# Altium project LED PD LKW WH 3000030 (4F00221L_7P00491A).PrjPcb
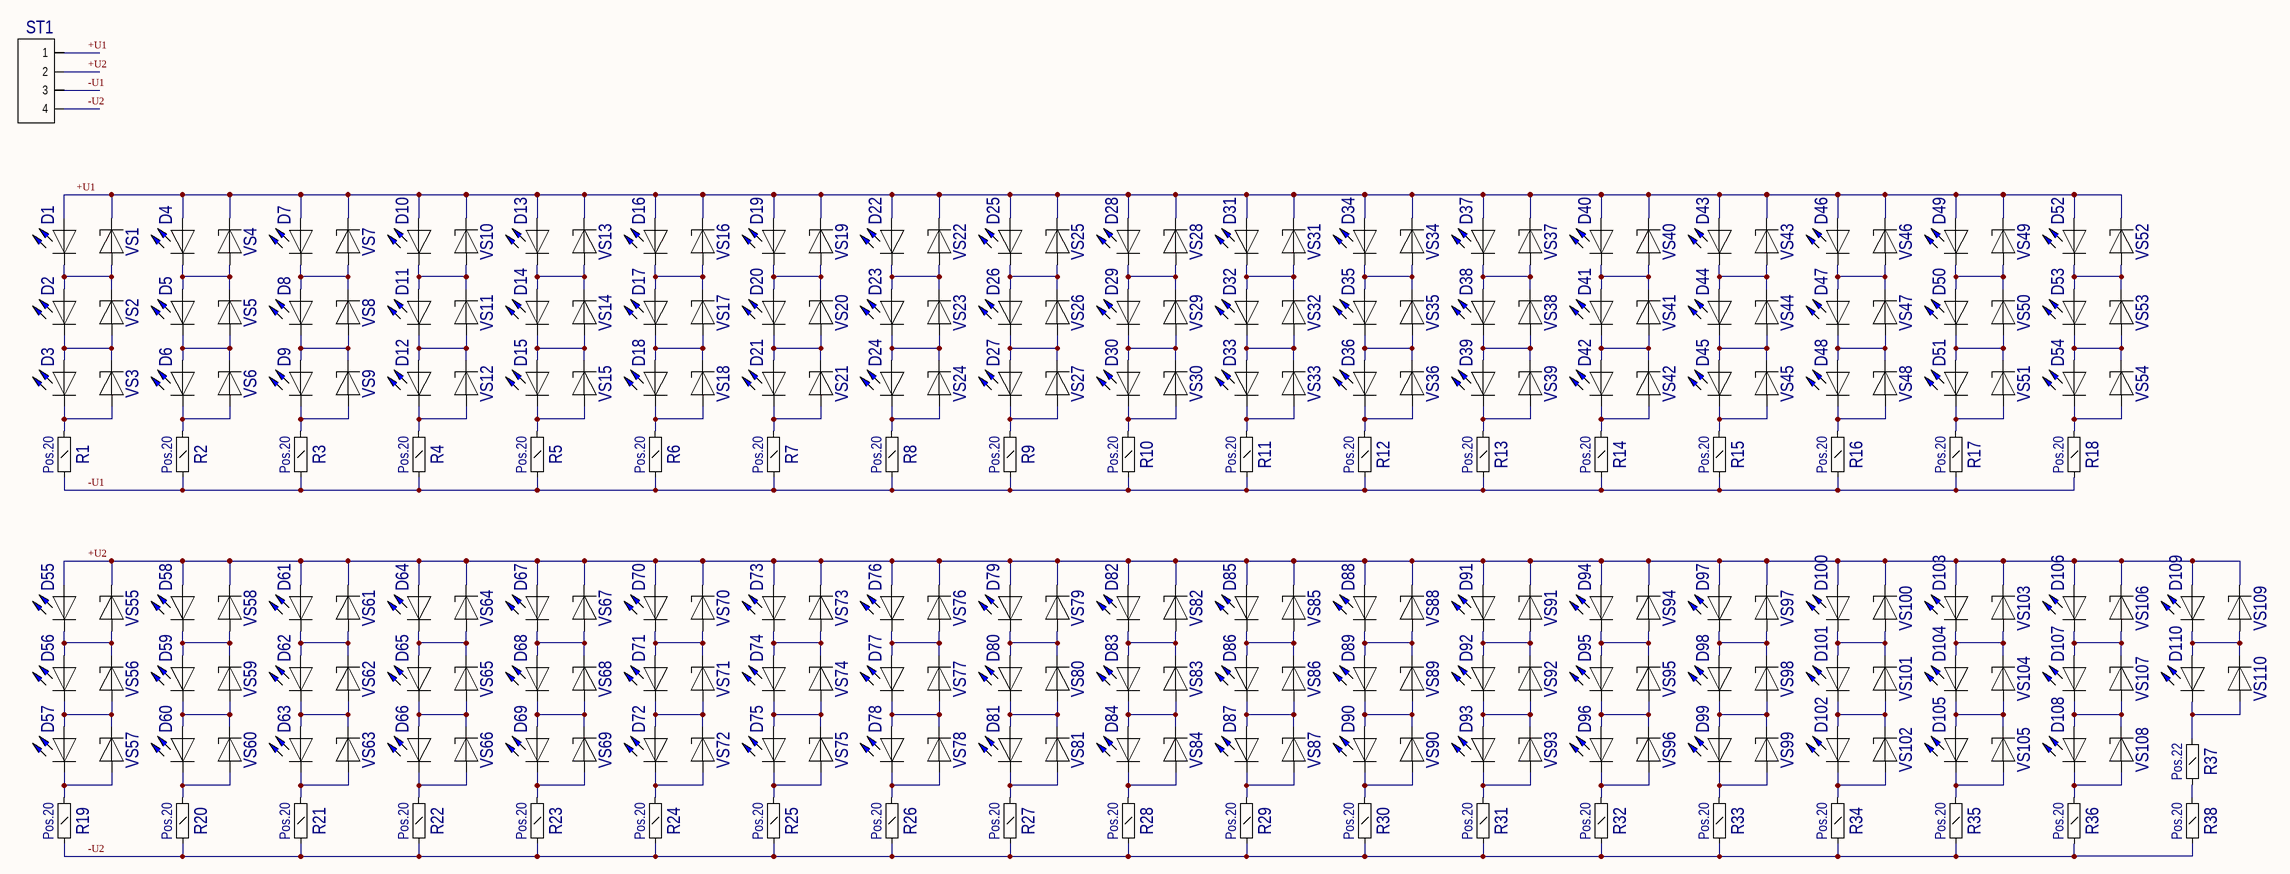
[diagram p0: LED PD LKW WH 3000030 (4F00221L_7P00491A).SchDoc]
1 sheet, 259 parts. Net scope: global (net labels, ports and power ports of the same name join across sheets).
Board file: LED PD LKW WH 3000030 (4F00221L_7P00491A).PcbDoc

## Sheet LED PD LKW WH 3000030 (4F00221L_7P00491A).SchDoc
size 529 x 241 mm

### Parts
D1  T66G_4  [T66G_4]  (value not drawn)
D2  T66G_4  [T66G_4]  (value not drawn)
D3  T66G_4  [T66G_4]  (value not drawn)
D4  T66G_4  [T66G_4]  (value not drawn)
D5  T66G_4  [T66G_4]  (value not drawn)
D6  T66G_4  [T66G_4]  (value not drawn)
D7  T66G_4  [T66G_4]  (value not drawn)
D8  T66G_4  [T66G_4]  (value not drawn)
D9  T66G_4  [T66G_4]  (value not drawn)
D10  T66G_4  [T66G_4]  (value not drawn)
D11  T66G_4  [T66G_4]  (value not drawn)
D12  T66G_4  [T66G_4]  (value not drawn)
D13  T66G_4  [T66G_4]  (value not drawn)
D14  T66G_4  [T66G_4]  (value not drawn)
D15  T66G_4  [T66G_4]  (value not drawn)
D16  T66G_4  [T66G_4]  (value not drawn)
D17  T66G_4  [T66G_4]  (value not drawn)
D18  T66G_4  [T66G_4]  (value not drawn)
D19  T66G_4  [T66G_4]  (value not drawn)
D20  T66G_4  [T66G_4]  (value not drawn)
D21  T66G_4  [T66G_4]  (value not drawn)
D22  T66G_4  [T66G_4]  (value not drawn)
D23  T66G_4  [T66G_4]  (value not drawn)
D24  T66G_4  [T66G_4]  (value not drawn)
D25  T66G_4  [T66G_4]  (value not drawn)
D26  T66G_4  [T66G_4]  (value not drawn)
D27  T66G_4  [T66G_4]  (value not drawn)
D28  T66G_4  [T66G_4]  (value not drawn)
D29  T66G_4  [T66G_4]  (value not drawn)
D30  T66G_4  [T66G_4]  (value not drawn)
D31  T66G_4  [T66G_4]  (value not drawn)
D32  T66G_4  [T66G_4]  (value not drawn)
D33  T66G_4  [T66G_4]  (value not drawn)
D34  T66G_4  [T66G_4]  (value not drawn)
D35  T66G_4  [T66G_4]  (value not drawn)
D36  T66G_4  [T66G_4]  (value not drawn)
D37  T66G_4  [T66G_4]  (value not drawn)
D38  T66G_4  [T66G_4]  (value not drawn)
D39  T66G_4  [T66G_4]  (value not drawn)
D40  T66G_4  [T66G_4]  (value not drawn)
D41  T66G_4  [T66G_4]  (value not drawn)
D42  T66G_4  [T66G_4]  (value not drawn)
D43  T66G_4  [T66G_4]  (value not drawn)
D44  T66G_4  [T66G_4]  (value not drawn)
D45  T66G_4  [T66G_4]  (value not drawn)
D46  T66G_4  [T66G_4]  (value not drawn)
D47  T66G_4  [T66G_4]  (value not drawn)
D48  T66G_4  [T66G_4]  (value not drawn)
D49  T66G_4  [T66G_4]  (value not drawn)
D50  T66G_4  [T66G_4]  (value not drawn)
D51  T66G_4  [T66G_4]  (value not drawn)
D52  T66G_4  [T66G_4]  (value not drawn)
D53  T66G_4  [T66G_4]  (value not drawn)
D54  T66G_4  [T66G_4]  (value not drawn)
D55  T66G_4  [T66G_4]  (value not drawn)
D56  T66G_4  [T66G_4]  (value not drawn)
D57  T66G_4  [T66G_4]  (value not drawn)
D58  T66G_4  [T66G_4]  (value not drawn)
D59  T66G_4  [T66G_4]  (value not drawn)
D60  T66G_4  [T66G_4]  (value not drawn)
D61  T66G_4  [T66G_4]  (value not drawn)
D62  T66G_4  [T66G_4]  (value not drawn)
D63  T66G_4  [T66G_4]  (value not drawn)
D64  T66G_4  [T66G_4]  (value not drawn)
D65  T66G_4  [T66G_4]  (value not drawn)
D66  T66G_4  [T66G_4]  (value not drawn)
D67  T66G_4  [T66G_4]  (value not drawn)
D68  T66G_4  [T66G_4]  (value not drawn)
D69  T66G_4  [T66G_4]  (value not drawn)
D70  T66G_4  [T66G_4]  (value not drawn)
D71  T66G_4  [T66G_4]  (value not drawn)
D72  T66G_4  [T66G_4]  (value not drawn)
D73  T66G_4  [T66G_4]  (value not drawn)
D74  T66G_4  [T66G_4]  (value not drawn)
D75  T66G_4  [T66G_4]  (value not drawn)
D76  T66G_4  [T66G_4]  (value not drawn)
D77  T66G_4  [T66G_4]  (value not drawn)
D78  T66G_4  [T66G_4]  (value not drawn)
D79  T66G_4  [T66G_4]  (value not drawn)
D80  T66G_4  [T66G_4]  (value not drawn)
D81  T66G_4  [T66G_4]  (value not drawn)
D82  T66G_4  [T66G_4]  (value not drawn)
D83  T66G_4  [T66G_4]  (value not drawn)
D84  T66G_4  [T66G_4]  (value not drawn)
D85  T66G_4  [T66G_4]  (value not drawn)
D86  T66G_4  [T66G_4]  (value not drawn)
D87  T66G_4  [T66G_4]  (value not drawn)
D88  T66G_4  [T66G_4]  (value not drawn)
D89  T66G_4  [T66G_4]  (value not drawn)
D90  T66G_4  [T66G_4]  (value not drawn)
D91  T66G_4  [T66G_4]  (value not drawn)
D92  T66G_4  [T66G_4]  (value not drawn)
D93  T66G_4  [T66G_4]  (value not drawn)
D94  T66G_4  [T66G_4]  (value not drawn)
D95  T66G_4  [T66G_4]  (value not drawn)
D96  T66G_4  [T66G_4]  (value not drawn)
D97  T66G_4  [T66G_4]  (value not drawn)
D98  T66G_4  [T66G_4]  (value not drawn)
D99  T66G_4  [T66G_4]  (value not drawn)
D100  T66G_4  [T66G_4]  (value not drawn)
D101  T66G_4  [T66G_4]  (value not drawn)
D102  T66G_4  [T66G_4]  (value not drawn)
D103  T66G_4  [T66G_4]  (value not drawn)
D104  T66G_4  [T66G_4]  (value not drawn)
D105  T66G_4  [T66G_4]  (value not drawn)
D106  T66G_4  [T66G_4]  (value not drawn)
D107  T66G_4  [T66G_4]  (value not drawn)
D108  T66G_4  [T66G_4]  (value not drawn)
D109  T66G_4  [T66G_4]  (value not drawn)
D110  T66G_4  [T66G_4]  (value not drawn)
R1  value Pos.20  [RC1206S]  (hidden comment: R1206S)
R2  value Pos.20  [RC1206S]  (hidden comment: R1206S)
R3  value Pos.20  [RC1206S]  (hidden comment: R1206S)
R4  value Pos.20  [RC1206S]  (hidden comment: R1206S)
R5  value Pos.20  [RC1206S]  (hidden comment: R1206S)
R6  value Pos.20  [RC1206S]  (hidden comment: R1206S)
R7  value Pos.20  [RC1206S]  (hidden comment: R1206S)
R8  value Pos.20  [RC1206S]  (hidden comment: R1206S)
R9  value Pos.20  [RC1206S]  (hidden comment: R1206S)
R10  value Pos.20  [RC1206S]  (hidden comment: R1206S)
R11  value Pos.20  [RC1206S]  (hidden comment: R1206S)
R12  value Pos.20  [RC1206S]  (hidden comment: R1206S)
R13  value Pos.20  [RC1206S]  (hidden comment: R1206S)
R14  value Pos.20  [RC1206S]  (hidden comment: R1206S)
R15  value Pos.20  [RC1206S]  (hidden comment: R1206S)
R16  value Pos.20  [RC1206S]  (hidden comment: R1206S)
R17  value Pos.20  [RC1206S]  (hidden comment: R1206S)
R18  value Pos.20  [RC1206S]  (hidden comment: R1206S)
R19  value Pos.20  [RC1206S]  (hidden comment: R1206S)
R20  value Pos.20  [RC1206S]  (hidden comment: R1206S)
R21  value Pos.20  [RC1206S]  (hidden comment: R1206S)
R22  value Pos.20  [RC1206S]  (hidden comment: R1206S)
R23  value Pos.20  [RC1206S]  (hidden comment: R1206S)
R24  value Pos.20  [RC1206S]  (hidden comment: R1206S)
R25  value Pos.20  [RC1206S]  (hidden comment: R1206S)
R26  value Pos.20  [RC1206S]  (hidden comment: R1206S)
R27  value Pos.20  [RC1206S]  (hidden comment: R1206S)
R28  value Pos.20  [RC1206S]  (hidden comment: R1206S)
R29  value Pos.20  [RC1206S]  (hidden comment: R1206S)
R30  value Pos.20  [RC1206S]  (hidden comment: R1206S)
R31  value Pos.20  [RC1206S]  (hidden comment: R1206S)
R32  value Pos.20  [RC1206S]  (hidden comment: R1206S)
R33  value Pos.20  [RC1206S]  (hidden comment: R1206S)
R34  value Pos.20  [RC1206S]  (hidden comment: R1206S)
R35  value Pos.20  [RC1206S]  (hidden comment: R1206S)
R36  value Pos.20  [RC1206S]  (hidden comment: R1206S)
R37  value Pos.22  [RC1206S]  (hidden comment: R1206S)
R38  value Pos.20  [RC1206S]  (hidden comment: R1206S)
ST1  BAND4  [BAND4]  (value not drawn)
VS1  BZX84  [SOT23]  (value not drawn)
VS2  BZX84  [SOT23]  (value not drawn)
VS3  BZX84  [SOT23]  (value not drawn)
VS4  BZX84  [SOT23]  (value not drawn)
VS5  BZX84  [SOT23]  (value not drawn)
VS6  BZX84  [SOT23]  (value not drawn)
VS7  BZX84  [SOT23]  (value not drawn)
VS8  BZX84  [SOT23]  (value not drawn)
VS9  BZX84  [SOT23]  (value not drawn)
VS10  BZX84  [SOT23]  (value not drawn)
VS11  BZX84  [SOT23]  (value not drawn)
VS12  BZX84  [SOT23]  (value not drawn)
VS13  BZX84  [SOT23]  (value not drawn)
VS14  BZX84  [SOT23]  (value not drawn)
VS15  BZX84  [SOT23]  (value not drawn)
VS16  BZX84  [SOT23]  (value not drawn)
VS17  BZX84  [SOT23]  (value not drawn)
VS18  BZX84  [SOT23]  (value not drawn)
VS19  BZX84  [SOT23]  (value not drawn)
VS20  BZX84  [SOT23]  (value not drawn)
VS21  BZX84  [SOT23]  (value not drawn)
VS22  BZX84  [SOT23]  (value not drawn)
VS23  BZX84  [SOT23]  (value not drawn)
VS24  BZX84  [SOT23]  (value not drawn)
VS25  BZX84  [SOT23]  (value not drawn)
VS26  BZX84  [SOT23]  (value not drawn)
VS27  BZX84  [SOT23]  (value not drawn)
VS28  BZX84  [SOT23]  (value not drawn)
VS29  BZX84  [SOT23]  (value not drawn)
VS30  BZX84  [SOT23]  (value not drawn)
VS31  BZX84  [SOT23]  (value not drawn)
VS32  BZX84  [SOT23]  (value not drawn)
VS33  BZX84  [SOT23]  (value not drawn)
VS34  BZX84  [SOT23]  (value not drawn)
VS35  BZX84  [SOT23]  (value not drawn)
VS36  BZX84  [SOT23]  (value not drawn)
VS37  BZX84  [SOT23]  (value not drawn)
VS38  BZX84  [SOT23]  (value not drawn)
VS39  BZX84  [SOT23]  (value not drawn)
VS40  BZX84  [SOT23]  (value not drawn)
VS41  BZX84  [SOT23]  (value not drawn)
VS42  BZX84  [SOT23]  (value not drawn)
VS43  BZX84  [SOT23]  (value not drawn)
VS44  BZX84  [SOT23]  (value not drawn)
VS45  BZX84  [SOT23]  (value not drawn)
VS46  BZX84  [SOT23]  (value not drawn)
VS47  BZX84  [SOT23]  (value not drawn)
VS48  BZX84  [SOT23]  (value not drawn)
VS49  BZX84  [SOT23]  (value not drawn)
VS50  BZX84  [SOT23]  (value not drawn)
VS51  BZX84  [SOT23]  (value not drawn)
VS52  BZX84  [SOT23]  (value not drawn)
VS53  BZX84  [SOT23]  (value not drawn)
VS54  BZX84  [SOT23]  (value not drawn)
VS55  BZX84  [SOT23]  (value not drawn)
VS56  BZX84  [SOT23]  (value not drawn)
VS57  BZX84  [SOT23]  (value not drawn)
VS58  BZX84  [SOT23]  (value not drawn)
VS59  BZX84  [SOT23]  (value not drawn)
VS60  BZX84  [SOT23]  (value not drawn)
VS61  BZX84  [SOT23]  (value not drawn)
VS62  BZX84  [SOT23]  (value not drawn)
VS63  BZX84  [SOT23]  (value not drawn)
VS64  BZX84  [SOT23]  (value not drawn)
VS65  BZX84  [SOT23]  (value not drawn)
VS66  BZX84  [SOT23]  (value not drawn)
VS67  BZX84  [SOT23]  (value not drawn)
VS68  BZX84  [SOT23]  (value not drawn)
VS69  BZX84  [SOT23]  (value not drawn)
VS70  BZX84  [SOT23]  (value not drawn)
VS71  BZX84  [SOT23]  (value not drawn)
VS72  BZX84  [SOT23]  (value not drawn)
VS73  BZX84  [SOT23]  (value not drawn)
VS74  BZX84  [SOT23]  (value not drawn)
VS75  BZX84  [SOT23]  (value not drawn)
VS76  BZX84  [SOT23]  (value not drawn)
VS77  BZX84  [SOT23]  (value not drawn)
VS78  BZX84  [SOT23]  (value not drawn)
VS79  BZX84  [SOT23]  (value not drawn)
VS80  BZX84  [SOT23]  (value not drawn)
VS81  BZX84  [SOT23]  (value not drawn)
VS82  BZX84  [SOT23]  (value not drawn)
VS83  BZX84  [SOT23]  (value not drawn)
VS84  BZX84  [SOT23]  (value not drawn)
VS85  BZX84  [SOT23]  (value not drawn)
VS86  BZX84  [SOT23]  (value not drawn)
VS87  BZX84  [SOT23]  (value not drawn)
VS88  BZX84  [SOT23]  (value not drawn)
VS89  BZX84  [SOT23]  (value not drawn)
VS90  BZX84  [SOT23]  (value not drawn)
VS91  BZX84  [SOT23]  (value not drawn)
VS92  BZX84  [SOT23]  (value not drawn)
VS93  BZX84  [SOT23]  (value not drawn)
VS94  BZX84  [SOT23]  (value not drawn)
VS95  BZX84  [SOT23]  (value not drawn)
VS96  BZX84  [SOT23]  (value not drawn)
VS97  BZX84  [SOT23]  (value not drawn)
VS98  BZX84  [SOT23]  (value not drawn)
VS99  BZX84  [SOT23]  (value not drawn)
VS100  BZX84  [SOT23]  (value not drawn)
VS101  BZX84  [SOT23]  (value not drawn)
VS102  BZX84  [SOT23]  (value not drawn)
VS103  BZX84  [SOT23]  (value not drawn)
VS104  BZX84  [SOT23]  (value not drawn)
VS105  BZX84  [SOT23]  (value not drawn)
VS106  BZX84  [SOT23]  (value not drawn)
VS107  BZX84  [SOT23]  (value not drawn)
VS108  BZX84  [SOT23]  (value not drawn)
VS109  BZX84  [SOT23]  (value not drawn)
VS110  BZX84  [SOT23]  (value not drawn)

### Nets
+U1: D1.2(A) D4.2(A) D7.2(A) D10.2(A) D13.2(A) D16.2(A) D19.2(A) D22.2(A) D25.2(A) D28.2(A) D31.2(A) D34.2(A) D37.2(A) D40.2(A) D43.2(A) D46.2(A) D49.2(A) D52.2(A) ST1.1 VS1.3 VS4.3 VS7.3 VS10.3 VS13.3 VS16.3 VS19.3 VS22.3 VS25.3 VS28.3 VS31.3 VS34.3 VS37.3 VS40.3 VS43.3 VS46.3 VS49.3 VS52.3
+U2: D55.2(A) D58.2(A) D61.2(A) D64.2(A) D67.2(A) D70.2(A) D73.2(A) D76.2(A) D79.2(A) D82.2(A) D85.2(A) D88.2(A) D91.2(A) D94.2(A) D97.2(A) D100.2(A) D103.2(A) D106.2(A) D109.2(A) ST1.2 VS55.3 VS58.3 VS61.3 VS64.3 VS67.3 VS70.3 VS73.3 VS76.3 VS79.3 VS82.3 VS85.3 VS88.3 VS91.3 VS94.3 VS97.3 VS100.3 VS103.3 VS106.3 VS109.3
-U1: R1.2 R2.2 R3.2 R4.2 R5.2 R6.2 R7.2 R8.2 R9.2 R10.2 R11.2 R12.2 R13.2 R14.2 R15.2 R16.2 R17.2 R18.2 ST1.3
-U2: R19.2 R20.2 R21.2 R22.2 R23.2 R24.2 R25.2 R26.2 R27.2 R28.2 R29.2 R30.2 R31.2 R32.2 R33.2 R34.2 R35.2 R36.2 R38.2 ST1.4
NetD1_1: D1.1(K) D2.2(A) VS1.1 VS2.3
NetD2_1: D2.1(K) D3.2(A) VS2.1 VS3.3
NetD3_1: D3.1(K) R1.1 VS3.1
NetD4_1: D4.1(K) D5.2(A) VS4.1 VS5.3
NetD5_1: D5.1(K) D6.2(A) VS5.1 VS6.3
NetD6_1: D6.1(K) R2.1 VS6.1
NetD7_1: D7.1(K) D8.2(A) VS7.1 VS8.3
NetD8_1: D8.1(K) D9.2(A) VS8.1 VS9.3
NetD9_1: D9.1(K) R3.1 VS9.1
NetD10_1: D10.1(K) D11.2(A) VS10.1 VS11.3
NetD11_1: D11.1(K) D12.2(A) VS11.1 VS12.3
NetD12_1: D12.1(K) R4.1 VS12.1
NetD13_1: D13.1(K) D14.2(A) VS13.1 VS14.3
NetD14_1: D14.1(K) D15.2(A) VS14.1 VS15.3
NetD15_1: D15.1(K) R5.1 VS15.1
NetD16_1: D16.1(K) D17.2(A) VS16.1 VS17.3
NetD17_1: D17.1(K) D18.2(A) VS17.1 VS18.3
NetD18_1: D18.1(K) R6.1 VS18.1
NetD19_1: D19.1(K) D20.2(A) VS19.1 VS20.3
NetD20_1: D20.1(K) D21.2(A) VS20.1 VS21.3
NetD21_1: D21.1(K) R7.1 VS21.1
NetD22_1: D22.1(K) D23.2(A) VS22.1 VS23.3
NetD23_1: D23.1(K) D24.2(A) VS23.1 VS24.3
NetD24_1: D24.1(K) R8.1 VS24.1
NetD25_1: D25.1(K) D26.2(A) VS25.1 VS26.3
NetD26_1: D26.1(K) D27.2(A) VS26.1 VS27.3
NetD27_1: D27.1(K) R9.1 VS27.1
NetD28_1: D28.1(K) D29.2(A) VS28.1 VS29.3
NetD29_1: D29.1(K) D30.2(A) VS29.1 VS30.3
NetD30_1: D30.1(K) R10.1 VS30.1
NetD31_1: D31.1(K) D32.2(A) VS31.1 VS32.3
NetD32_1: D32.1(K) D33.2(A) VS32.1 VS33.3
NetD33_1: D33.1(K) R11.1 VS33.1
NetD34_1: D34.1(K) D35.2(A) VS34.1 VS35.3
NetD35_1: D35.1(K) D36.2(A) VS35.1 VS36.3
NetD36_1: D36.1(K) R12.1 VS36.1
NetD37_1: D37.1(K) D38.2(A) VS37.1 VS38.3
NetD38_1: D38.1(K) D39.2(A) VS38.1 VS39.3
NetD39_1: D39.1(K) R13.1 VS39.1
NetD40_1: D40.1(K) D41.2(A) VS40.1 VS41.3
NetD41_1: D41.1(K) D42.2(A) VS41.1 VS42.3
NetD42_1: D42.1(K) R14.1 VS42.1
NetD43_1: D43.1(K) D44.2(A) VS43.1 VS44.3
NetD44_1: D44.1(K) D45.2(A) VS44.1 VS45.3
NetD45_1: D45.1(K) R15.1 VS45.1
NetD46_1: D46.1(K) D47.2(A) VS46.1 VS47.3
NetD47_1: D47.1(K) D48.2(A) VS47.1 VS48.3
NetD48_1: D48.1(K) R16.1 VS48.1
NetD49_1: D49.1(K) D50.2(A) VS49.1 VS50.3
NetD50_1: D50.1(K) D51.2(A) VS50.1 VS51.3
NetD51_1: D51.1(K) R17.1 VS51.1
NetD52_1: D52.1(K) D53.2(A) VS52.1 VS53.3
NetD53_1: D53.1(K) D54.2(A) VS53.1 VS54.3
NetD54_1: D54.1(K) R18.1 VS54.1
NetD55_1: D55.1(K) D56.2(A) VS55.1 VS56.3
NetD56_1: D56.1(K) D57.2(A) VS56.1 VS57.3
NetD57_1: D57.1(K) R19.1 VS57.1
NetD58_1: D58.1(K) D59.2(A) VS58.1 VS59.3
NetD59_1: D59.1(K) D60.2(A) VS59.1 VS60.3
NetD60_1: D60.1(K) R20.1 VS60.1
NetD61_1: D61.1(K) D62.2(A) VS61.1 VS62.3
NetD62_1: D62.1(K) D63.2(A) VS62.1 VS63.3
NetD63_1: D63.1(K) R21.1 VS63.1
NetD64_1: D64.1(K) D65.2(A) VS64.1 VS65.3
NetD65_1: D65.1(K) D66.2(A) VS65.1 VS66.3
NetD66_1: D66.1(K) R22.1 VS66.1
NetD67_1: D67.1(K) D68.2(A) VS67.1 VS68.3
NetD68_1: D68.1(K) D69.2(A) VS68.1 VS69.3
NetD69_1: D69.1(K) R23.1 VS69.1
NetD70_1: D70.1(K) D71.2(A) VS70.1 VS71.3
NetD71_1: D71.1(K) D72.2(A) VS71.1 VS72.3
NetD72_1: D72.1(K) R24.1 VS72.1
NetD73_1: D73.1(K) D74.2(A) VS73.1 VS74.3
NetD74_1: D74.1(K) D75.2(A) VS74.1 VS75.3
NetD75_1: D75.1(K) R25.1 VS75.1
NetD76_1: D76.1(K) D77.2(A) VS76.1 VS77.3
NetD77_1: D77.1(K) D78.2(A) VS77.1 VS78.3
NetD78_1: D78.1(K) R26.1 VS78.1
NetD79_1: D79.1(K) D80.2(A) VS79.1 VS80.3
NetD80_1: D80.1(K) D81.2(A) VS80.1 VS81.3
NetD81_1: D81.1(K) R27.1 VS81.1
NetD82_1: D82.1(K) D83.2(A) VS82.1 VS83.3
NetD83_1: D83.1(K) D84.2(A) VS83.1 VS84.3
NetD84_1: D84.1(K) R28.1 VS84.1
NetD85_1: D85.1(K) D86.2(A) VS85.1 VS86.3
NetD86_1: D86.1(K) D87.2(A) VS86.1 VS87.3
NetD87_1: D87.1(K) R29.1 VS87.1
NetD88_1: D88.1(K) D89.2(A) VS88.1 VS89.3
NetD89_1: D89.1(K) D90.2(A) VS89.1 VS90.3
NetD90_1: D90.1(K) R30.1 VS90.1
NetD91_1: D91.1(K) D92.2(A) VS91.1 VS92.3
NetD92_1: D92.1(K) D93.2(A) VS92.1 VS93.3
NetD93_1: D93.1(K) R31.1 VS93.1
NetD94_1: D94.1(K) D95.2(A) VS94.1 VS95.3
NetD95_1: D95.1(K) D96.2(A) VS95.1 VS96.3
NetD96_1: D96.1(K) R32.1 VS96.1
NetD97_1: D97.1(K) D98.2(A) VS97.1 VS98.3
NetD98_1: D98.1(K) D99.2(A) VS98.1 VS99.3
NetD99_1: D99.1(K) R33.1 VS99.1
NetD100_1: D100.1(K) D101.2(A) VS100.1 VS101.3
NetD101_1: D101.1(K) D102.2(A) VS101.1 VS102.3
NetD102_1: D102.1(K) R34.1 VS102.1
NetD103_1: D103.1(K) D104.2(A) VS103.1 VS104.3
NetD104_1: D104.1(K) D105.2(A) VS104.1 VS105.3
NetD105_1: D105.1(K) R35.1 VS105.1
NetD106_1: D106.1(K) D107.2(A) VS106.1 VS107.3
NetD107_1: D107.1(K) D108.2(A) VS107.1 VS108.3
NetD108_1: D108.1(K) R36.1 VS108.1
NetD109_1: D109.1(K) D110.2(A) VS109.1 VS110.3
NetD110_1: D110.1(K) R37.1 VS110.1
NetR37_2: R37.2 R38.1

Not connected (* = marked no-connect by the designer): ST1 5 6 7 8; VS1 2; VS2 2; VS3 2; VS4 2; VS5 2; VS6 2; VS7 2; VS8 2; VS9 2; VS10 2; VS11 2; VS12 2; VS13 2; VS14 2; VS15 2; VS16 2; VS17 2; VS18 2; VS19 2; VS20 2; VS21 2; VS22 2; VS23 2; VS24 2; VS25 2; VS26 2; VS27 2; VS28 2; VS29 2; VS30 2; VS31 2; VS32 2; VS33 2; VS34 2; VS35 2; VS36 2; VS37 2; VS38 2; VS39 2; VS40 2; VS41 2; VS42 2; VS43 2; VS44 2; VS45 2; VS46 2; VS47 2; VS48 2; VS49 2; VS50 2; VS51 2; VS52 2; VS53 2; VS54 2; VS55 2; VS56 2; VS57 2; VS58 2; VS59 2; VS60 2; VS61 2; VS62 2; VS63 2; VS64 2; VS65 2; VS66 2; VS67 2; VS68 2; VS69 2; VS70 2; VS71 2; VS72 2; VS73 2; VS74 2; VS75 2; VS76 2; VS77 2; VS78 2; VS79 2; VS80 2; VS81 2; VS82 2; VS83 2; VS84 2; VS85 2; VS86 2; VS87 2; VS88 2; VS89 2; VS90 2; VS91 2; VS92 2; VS93 2; VS94 2; VS95 2; VS96 2; VS97 2; VS98 2; VS99 2; VS100 2; VS101 2; VS102 2; VS103 2; VS104 2; VS105 2; VS106 2; VS107 2; VS108 2; VS109 2; VS110 2

### Library data of the parts
D1-D110 = T66G_4: {Description}
R37 = R1206S_1
VS1-VS110 = BZX84: OriginalName: DIODE; Value: *
ST1 = BAND4: Value: *